# Altium schematic sheet Motor_Driver.SchDoc
size A4; Organization: Altium Limited; Address1: 3 Minna Close; Address2: Belrose; Address3: NSW 2085; Address4: Australia
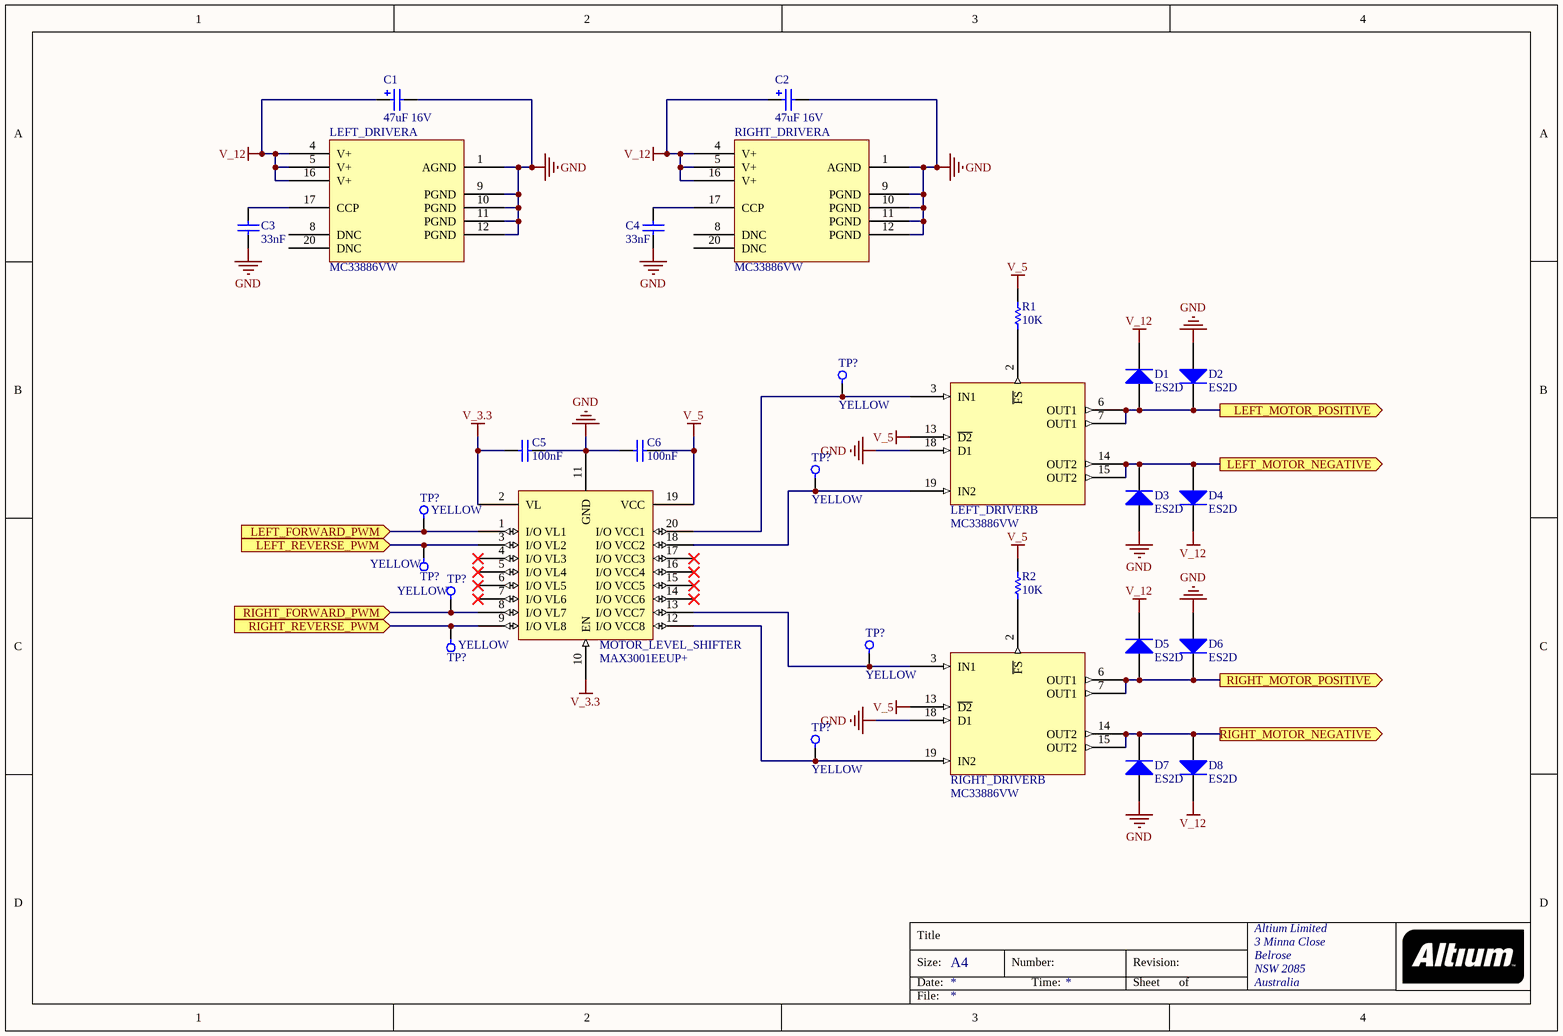
[diagram p0: Motor_Driver.SchDoc]

## Parts
(Parts that share a designator on the sheet are numbered #1, #2 ... from top to bottom, then left to right.)
C1  47uF 16V  [TANT7343]
C2  47uF 16V  [TANT7343]
C3  33nF  [CC0603]
C4  33nF  [CC0603]
C5  100nF  [CC0603]
C6  100nF  [CC0603]
D1  ES2D  [DIODE_SMB]
D2  ES2D  [DIODE_SMB]
D3  ES2D  [DIODE_SMB]
D4  ES2D  [DIODE_SMB]
D5  ES2D  [DIODE_SMB]
D6  ES2D  [DIODE_SMB]
D7  ES2D  [DIODE_SMB]
D8  ES2D  [DIODE_SMB]
LEFT_DRIVER  MC33886VW  [SOP127P1420X340_HS-20N]  (parts A,B of 2)
MOTOR_LEVEL_SHIFTER  MAX3001EEUP+  [TSOP65P640X110-20N]
R1  10K  [R0603]
R2  10K  [R0603]
RIGHT_DRIVER  MC33886VW  [SOP127P1420X340_HS-20N]  (parts A,B of 2)
TP?#1  YELLOW  [testpoint-small]
TP?#2  YELLOW  [testpoint-small]
TP?#3  YELLOW  [testpoint-small]
TP?#4  YELLOW  [testpoint-small]
TP?#5  YELLOW  [testpoint-small]
TP?#6  YELLOW  [testpoint-small]
TP?#7  YELLOW  [testpoint-small]
TP?#8  YELLOW  [testpoint-small]

## Ports
LEFT_FORWARD_PWM (in), LEFT_MOTOR_NEGATIVE (out), LEFT_MOTOR_POSITIVE (out), LEFT_REVERSE_PWM (in), RIGHT_FORWARD_PWM (in), RIGHT_MOTOR_NEGATIVE (out), RIGHT_MOTOR_POSITIVE (out), RIGHT_REVERSE_PWM (in)

## Nets
GND: C1.2 C2.2 C3.1 C4.1 C5.2 C6.1 D2.1(A) D3.1(A) D6.1(A) D7.1(A) LEFT_DRIVER.1(AGND) LEFT_DRIVER.9(PGND) LEFT_DRIVER.10(PGND) LEFT_DRIVER.11(PGND) LEFT_DRIVER.12(PGND) LEFT_DRIVER.18(D1) MOTOR_LEVEL_SHIFTER.11(GND) RIGHT_DRIVER.1(AGND) RIGHT_DRIVER.9(PGND) RIGHT_DRIVER.10(PGND) RIGHT_DRIVER.11(PGND) RIGHT_DRIVER.12(PGND) RIGHT_DRIVER.18(D1)
V_3.3: C5.1 MOTOR_LEVEL_SHIFTER.2(VL) MOTOR_LEVEL_SHIFTER.10(EN)
V_5: C6.2 LEFT_DRIVER.13(~{D2}) MOTOR_LEVEL_SHIFTER.19(VCC) R1.2 R2.2 RIGHT_DRIVER.13(~{D2})
V_12: C1.1 C2.1 D1.2(K) D4.2(K) D5.2(K) D8.2(K) LEFT_DRIVER.4(V+) LEFT_DRIVER.5(V+) LEFT_DRIVER.16(V+) RIGHT_DRIVER.4(V+) RIGHT_DRIVER.5(V+) RIGHT_DRIVER.16(V+)
LEFT_FORWARD_PWM: MOTOR_LEVEL_SHIFTER.1(I/O_VL1) TP?#3.1 ; port LEFT_FORWARD_PWM
LEFT_MOTOR_NEGATIVE: D3.2(K) D4.1(A) LEFT_DRIVER.14(OUT2) LEFT_DRIVER.15(OUT2) ; port LEFT_MOTOR_NEGATIVE
LEFT_MOTOR_POSITIVE: D1.1(A) D2.2(K) LEFT_DRIVER.6(OUT1) LEFT_DRIVER.7(OUT1) ; port LEFT_MOTOR_POSITIVE
LEFT_REVERSE_PWM: MOTOR_LEVEL_SHIFTER.3(I/O_VL2) TP?#4.1 ; port LEFT_REVERSE_PWM
RIGHT_FORWARD_PWM: MOTOR_LEVEL_SHIFTER.8(I/O_VL7) TP?#5.1 ; port RIGHT_FORWARD_PWM
RIGHT_MOTOR_NEGATIVE: D7.2(K) D8.1(A) RIGHT_DRIVER.14(OUT2) RIGHT_DRIVER.15(OUT2) ; port RIGHT_MOTOR_NEGATIVE
RIGHT_MOTOR_POSITIVE: D5.1(A) D6.2(K) RIGHT_DRIVER.6(OUT1) RIGHT_DRIVER.7(OUT1) ; port RIGHT_MOTOR_POSITIVE
RIGHT_REVERSE_PWM: MOTOR_LEVEL_SHIFTER.9(I/O_VL8) TP?#7.1 ; port RIGHT_REVERSE_PWM
NetC3_2: C3.2 LEFT_DRIVER.17(CCP)
NetC4_2: C4.2 RIGHT_DRIVER.17(CCP)
NetLEFT_DRIVER_2: LEFT_DRIVER.2(~{FS}) R1.1
NetLEFT_DRIVER_3: LEFT_DRIVER.3(IN1) MOTOR_LEVEL_SHIFTER.20(I/O_VCC1) TP?#1.1
NetLEFT_DRIVER_19: LEFT_DRIVER.19(IN2) MOTOR_LEVEL_SHIFTER.18(I/O_VCC2) TP?#2.1
NetMOTOR_LEVEL_SHIFTER_12: MOTOR_LEVEL_SHIFTER.12(I/O_VCC8) RIGHT_DRIVER.19(IN2) TP?#8.1
NetMOTOR_LEVEL_SHIFTER_13: MOTOR_LEVEL_SHIFTER.13(I/O_VCC7) RIGHT_DRIVER.3(IN1) TP?#6.1
NetR2_1: R2.1 RIGHT_DRIVER.2(~{FS})

Not connected (* = marked no-connect by the designer): LEFT_DRIVER 8(DNC) 20(DNC); MOTOR_LEVEL_SHIFTER 4(I/O_VL3)* 5(I/O_VL4)* 6(I/O_VL5)* 7(I/O_VL6)* 14(I/O_VCC6)* 15(I/O_VCC5)* 16(I/O_VCC4)* 17(I/O_VCC3)*; RIGHT_DRIVER 8(DNC) 20(DNC)

## Notes on the sheet
- Title
- Size:
- Date:
- A4
- Number:
- Time:
- Revision:
- Sheet
- of
- File:

## Library data of the parts
C1 C2 = TANT47uF_16V_7343: SM Tantalum Cap; Supplier_Component_Code: RZ-6574; published: 12/03/2007 11:34:36 a.m.; Supplier_Name: Soanar Plus; price: 1.9; value: 47uF 16V; Part Number: TANT47uF_16V_7343; Component Kind: Standard; Component Type: Standard; Designator: TANT47uF_16V_7343; Pin Count: 2
C3 C4 = 33nF_CC0603: 0603 Capacitor; Supplier_Component_Code: RC-P099; published: 28/03/2007 10:54:57 a.m.; Supplier_Name: Soanar Plus; price: 0.09; value: 33nF; Part Number: 33nF_CC0603; Component Kind: Standard; Component Type: Standard; Designator: 33nF_CC0603; Pin Count: 2
C5 C6 = 100nF_CC0603: 0603 Capacitor; Supplier_Component_Code: RC-P100; published: 28/03/2007 10:54:57 a.m.; Supplier_Name: Soanar Plus; price: 0.09; value: 100nF; Part Number: 100nF_CC0603; Component Kind: Standard; Component Type: Standard; Designator: 100nF_CC0603; Pin Count: 2
D1-D8 = ES2D-E3/52T: DIODE ULTRA FAST 2A 200V SMB; ECE_Component_Code: ES2D-E3/52T; value: ES2D; Supplier_Component_Code: ES2D-E3/52TGICT-ND; published: 31/05/2007; Supplier_Name: Digikey; price: 0.26; Part Number: ES2D-E3/52T; Component Kind: Standard; Component Type: Standard; Designator: ES2D-E3/52T; Pin Count: 2
R1 R2 = 10K_R0603: 0603 Resistor; ECE_Component_Code: 10K_R0603; value: 10K; Supplier_Component_Code: RS-S097; published: 12/03/2007 11:34:34 a.m.; Supplier_Name: Soanar Plus; price: 0.08; Part Number: 10K_R0603; Component Kind: Standard; Component Type: Standard; Designator: 10K_R0603; Pin Count: 2
TP?#1-TP?#8 = TP5004: TEST POINT PC MINI .040"D YELLOW; ECE_Component_Code: TP5004; Supplier_Component_Code: 5004K-ND; published: 12/06/2007; Supplier_Name: Digikey; price: 0.3; value: YELLOW; Part Number: TP5004; Component Kind: Standard; Component Type: Standard; Designator: TP5004; Pin Count: 1